# EAGLE schematic boneclamp (EAGLE 6.4)

## Sheet 1 of 7: Beaglebone interface
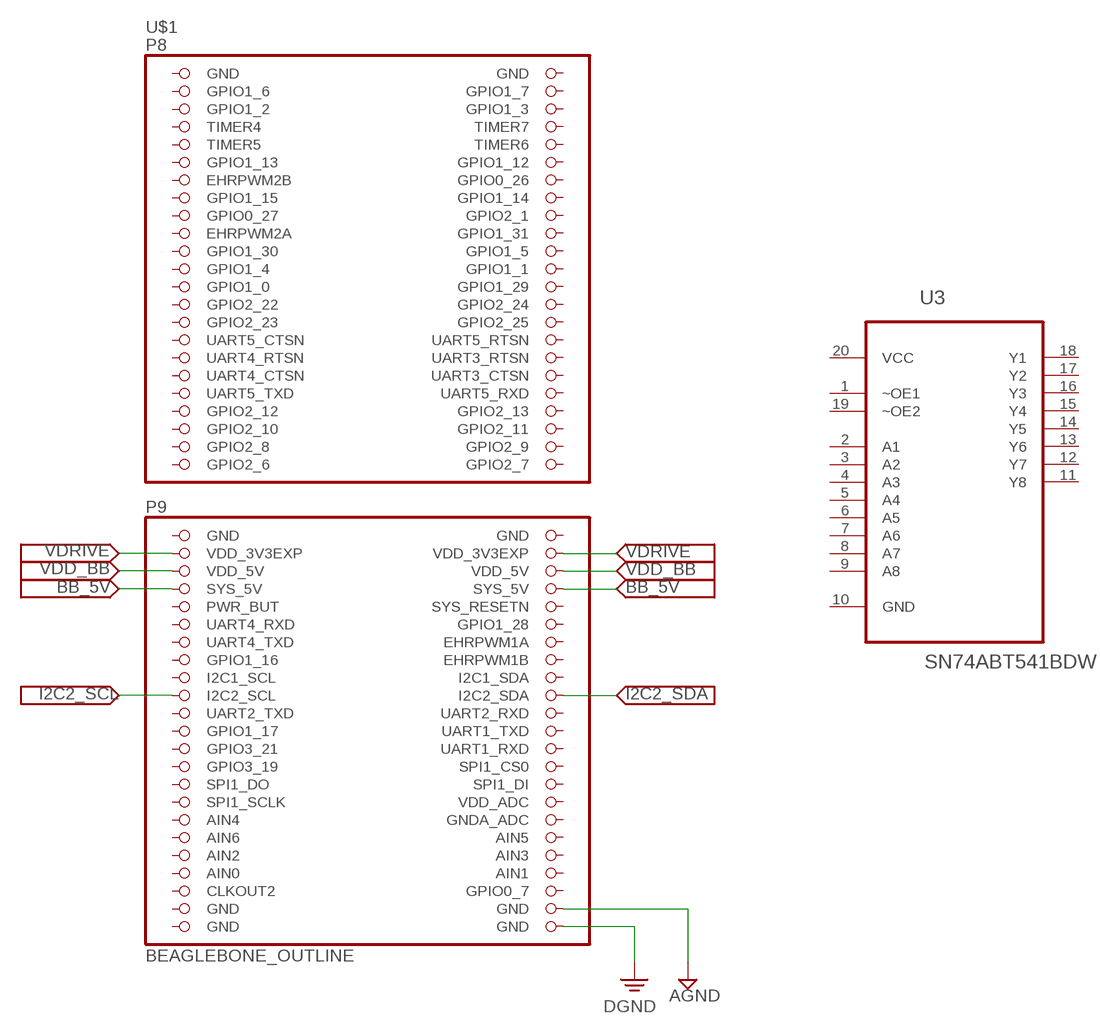
[diagram p0: schematic, sheet 1]

### Parts
U3  SN74ABT541BDW  [SOIC127P1030X265-20N]
U$1  BEAGLEBONE_OUTLINE  [BEAGLEBONE_SHIELD]

### Nets
AGND: U$1.90(GND) ; also sheet 2,4,6,7
BB_5V: U$1.53(SYS_5V) U$1.54(SYS_5V) ; also sheet 6
DGND: U$1.92(GND) ; also sheet 2,5,6
I2C2_SCL: U$1.65(I2C2_SCL) ; also sheet 5
I2C2_SDA: U$1.66(I2C2_SDA) ; also sheet 5
VDD_BB: U$1.51(VDD_5V) U$1.52(VDD_5V) ; also sheet 6
VDRIVE: U$1.49(VDD_3V3EXP) U$1.50(VDD_3V3EXP) ; also sheet 2,5
Unconnected: U3.1(~OE1) U3.2(A1) U3.3(A2) U3.4(A3) U3.5(A4) U3.6(A5) U3.7(A6) U3.8(A7) U3.9(A8) U3.10(GND) U3.11(Y8) U3.12(Y7) U3.13(Y6) U3.14(Y5) U3.15(Y4) U3.16(Y3) U3.17(Y2) U3.18(Y1) U3.19(~OE2) U$1.3(GPIO1_6) U$1.4(GPIO1_7) U$1.5(GPIO1_2) U$1.6(GPIO1_3) U$1.7(TIMER4) U$1.8(TIMER7) U$1.9(TIMER5) U$1.10(TIMER6) U$1.11(GPIO1_13) U$1.12(GPIO1_12) U$1.13(EHRPWM2B) U$1.14(GPIO0_26) U$1.15(GPIO1_15) U$1.16(GPIO1_14) U$1.17(GPIO0_27) U$1.18(GPIO2_1) U$1.19(EHRPWM2A) U$1.20(GPIO1_31) U$1.21(GPIO1_30) U$1.22(GPIO1_5) U$1.23(GPIO1_4) U$1.24(GPIO1_1) U$1.25(GPIO1_0) U$1.26(GPIO1_29) U$1.27(GPIO2_22) U$1.28(GPIO2_24) U$1.29(GPIO2_23) U$1.30(GPIO2_25) U$1.31(UART5_CTSN) U$1.32(UART5_RTSN) U$1.33(UART4_RTSN) U$1.34(UART3_RTSN) U$1.35(UART4_CTSN) U$1.36(UART3_CTSN) U$1.37(UART5_TXD) U$1.38(UART5_RXD) U$1.39(GPIO2_12) U$1.40(GPIO2_13) U$1.41(GPIO2_10) U$1.42(GPIO2_11) U$1.43(GPIO2_8) U$1.44(GPIO2_9) U$1.45(GPIO2_6) U$1.46(GPIO2_7) U$1.55(PWR_BUT) U$1.56(SYS_RESETN) U$1.57(UART4_RXD) U$1.58(GPIO1_28) U$1.59(UART4_TXD) U$1.60(EHRPWM1A) U$1.61(GPIO1_16) U$1.62(EHRPWM1B) U$1.63(I2C1_SCL) U$1.64(I2C1_SDA) U$1.67(UART2_TXD) U$1.68(UART2_RXD) U$1.69(GPIO1_17) U$1.70(UART1_TXD) U$1.71(GPIO3_21) U$1.72(UART1_RXD) U$1.73(GPIO3_19) U$1.74(SPI1_CS0) U$1.75(SPI1_DO) U$1.76(SPI1_DI) U$1.77(SPI1_SCLK) U$1.78(VDD_ADC) U$1.79(AIN4) U$1.80(GNDA_ADC) U$1.81(AIN6) U$1.82(AIN5) U$1.83(AIN2) U$1.84(AIN3) U$1.86(AIN1) U$1.87(CLKOUT2) U$1.88(GPIO0_7)

## Sheet 2 of 7: ADC
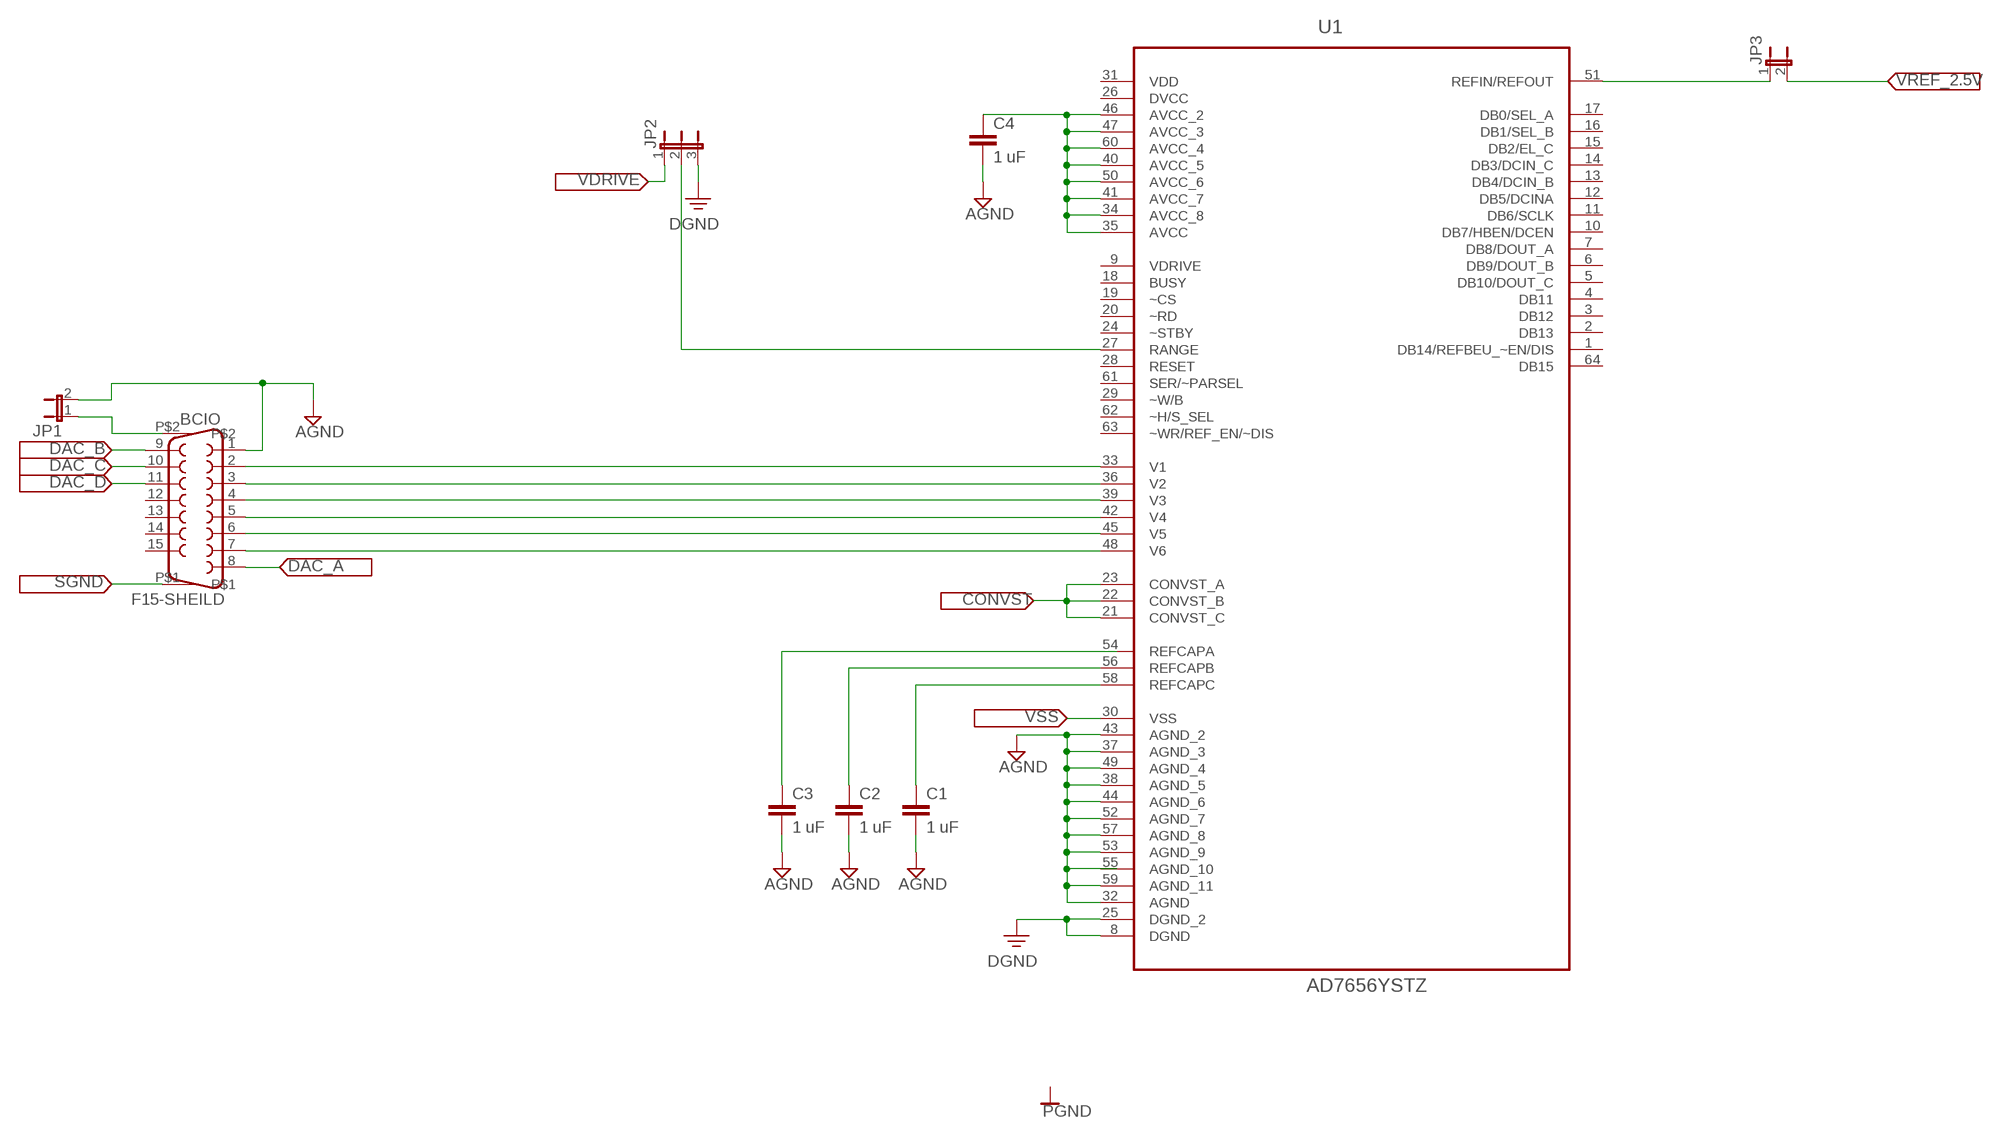
[diagram p1: schematic, sheet 2]

### Parts
BCIO  F15-SHEILD  [HDF15H]
C1  1 uF  C-EUC0402  [C0402]
C2  1 uF  C-EUC0402  [C0402]
C3  1 uF  C-EUC0402  [C0402]
C4  1 uF  C-EUC0402  [C0402]
JP1  JP1E  [JP1]
JP2  JP2E  [JP2]
JP3  JP1E  [JP1]
U1  AD7656YSTZ  [QFP50P1200X1200X160-64N]

### Nets
AGND: BCIO.1 C1.2 C2.2 C3.2 C4.2 JP1.2 U1.32(AGND) U1.37(AGND_3) U1.38(AGND_5) U1.43(AGND_2) U1.44(AGND_6) U1.49(AGND_4) U1.52(AGND_7) U1.53(AGND_9) U1.57(AGND_8) U1.59(AGND_11) ; also sheet 1,4,6,7
CONVST: U1.21(CONVST_C) U1.22(CONVST_B) U1.23(CONVST_A)
DAC_A: BCIO.8 ; also sheet 4
DAC_B: BCIO.9 ; also sheet 4
DAC_C: BCIO.10 ; also sheet 4
DAC_D: BCIO.11 ; also sheet 4
DGND: JP2.3 U1.8(DGND) U1.25(DGND_2) ; also sheet 1,5,6
N$1: BCIO.2 U1.33(V1)
N$2: BCIO.3 U1.36(V2)
N$3: BCIO.4 U1.39(V3)
N$4: BCIO.5 U1.42(V4)
N$5: BCIO.6 U1.45(V5)
N$6: BCIO.7 U1.48(V6)
N$9: C3.1
N$10: C2.1 U1.56(REFCAPB)
N$11: C1.1 U1.58(REFCAPC)
N$12: JP2.2 U1.27(RANGE)
N$13: C4.1 U1.34(AVCC_8) U1.35(AVCC) U1.40(AVCC_5) U1.41(AVCC_7) U1.46(AVCC_2) U1.47(AVCC_3) U1.50(AVCC_6) U1.60(AVCC_4)
N$20: JP3.1 U1.51(REFIN/REFOUT)
SGND: BCIO.P$1 BCIO.P$2 JP1.1
VDRIVE: JP2.1 ; also sheet 1,5
VREF_2.5V: JP3.2 ; also sheet 4,7
VSS: U1.30(VSS) ; also sheet 4
Unconnected: BCIO.12 BCIO.13 BCIO.14 BCIO.15 U1.1(DB14/REFBEU_~EN/DIS) U1.2(DB13) U1.3(DB12) U1.4(DB11) U1.5(DB10/DOUT_C) U1.6(DB9/DOUT_B) U1.7(DB8/DOUT_A) U1.9(VDRIVE) U1.10(DB7/HBEN/DCEN) U1.11(DB6/SCLK) U1.12(DB5/DCINA) U1.13(DB4/DCIN_B) U1.14(DB3/DCIN_C) U1.15(DB2/EL_C) U1.16(DB1/SEL_B) U1.17(DB0/SEL_A) U1.18(BUSY) U1.19(~CS) U1.20(~RD) U1.24(~STBY) U1.28(RESET) U1.29(~W/B) U1.54(REFCAPA) U1.55(AGND_10) U1.61(SER/~PARSEL) U1.62(~H/S_SEL) U1.63(~WR/REF_EN/~DIS) U1.64(DB15)

## Sheet 3 of 7: FILTERS

## Sheet 4 of 7: DAC
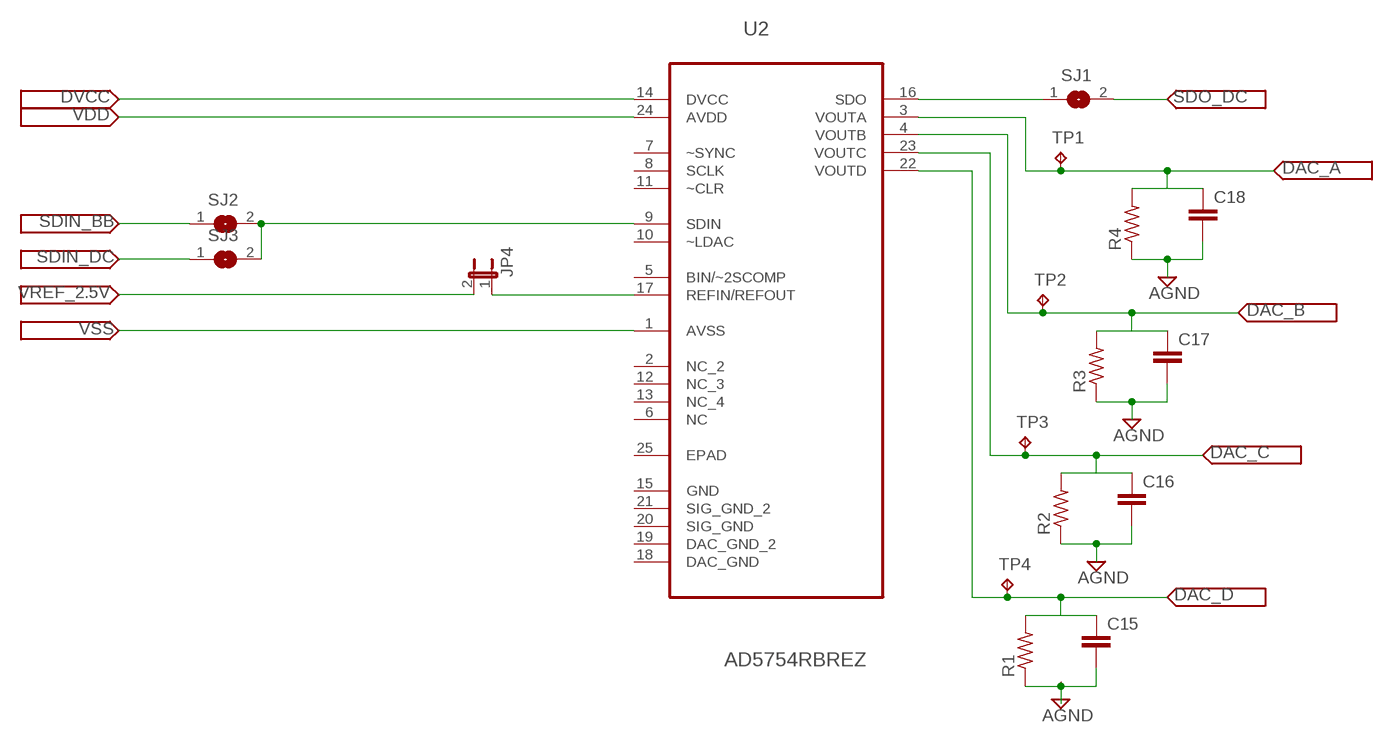
[diagram p2: schematic, sheet 4]

### Parts
C15  C-EUC0603  [C0603]
C16  C-EUC0603  [C0603]
C17  C-EUC0603  [C0603]
C18  C-EUC0603  [C0603]
JP4  JP1E  [JP1]
R1  R-US_R0603  [R0603]
R2  R-US_R0603  [R0603]
R3  R-US_R0603  [R0603]
R4  R-US_R0603  [R0603]
SJ1  SJ  [SJ]
SJ2  SJ  [SJ]
SJ3  SJ  [SJ]
TP1  TPB1,27  [B1,27]
TP2  TPB1,27  [B1,27]
TP3  TPB1,27  [B1,27]
TP4  TPB1,27  [B1,27]
U2  AD5754RBREZ  [SOP65P640X120-25N]

### Nets
AGND: C16.2 C17.2 C18.2 R2.1 R3.1 R4.1 ; also sheet 1,2,6,7
DAC_A: C18.1 R4.2 TP1.TP U2.3(VOUTA) ; also sheet 2
DAC_B: C17.1 R3.2 TP2.TP U2.4(VOUTB) ; also sheet 2
DAC_C: C16.1 R2.2 TP3.TP U2.23(VOUTC) ; also sheet 2
DAC_D: C15.1 R1.2 TP4.TP U2.22(VOUTD) ; also sheet 2
DVCC: U2.14(DVCC) ; also sheet 6
N$7: SJ1.1 U2.16(SDO)
N$8: SJ2.2 SJ3.2 U2.9(SDIN)
N$17: C15.2 R1.1
N$24: JP4.1 U2.17(REFIN/REFOUT)
SDIN_BB: SJ2.1
SDIN_DC: SJ3.1
SDO_DC: SJ1.2
VDD: U2.24(AVDD) ; also sheet 7
VREF_2.5V: JP4.2 ; also sheet 2,7
VSS: U2.1(AVSS) ; also sheet 2
Unconnected: U2.2(NC_2) U2.5(BIN/~2SCOMP) U2.6(NC) U2.7(~SYNC) U2.8(SCLK) U2.10(~LDAC) U2.11(~CLR) U2.12(NC_3) U2.13(NC_4) U2.15(GND) U2.18(DAC_GND) U2.19(DAC_GND_2) U2.20(SIG_GND) U2.21(SIG_GND_2)

## Sheet 5 of 7: BOARD ID
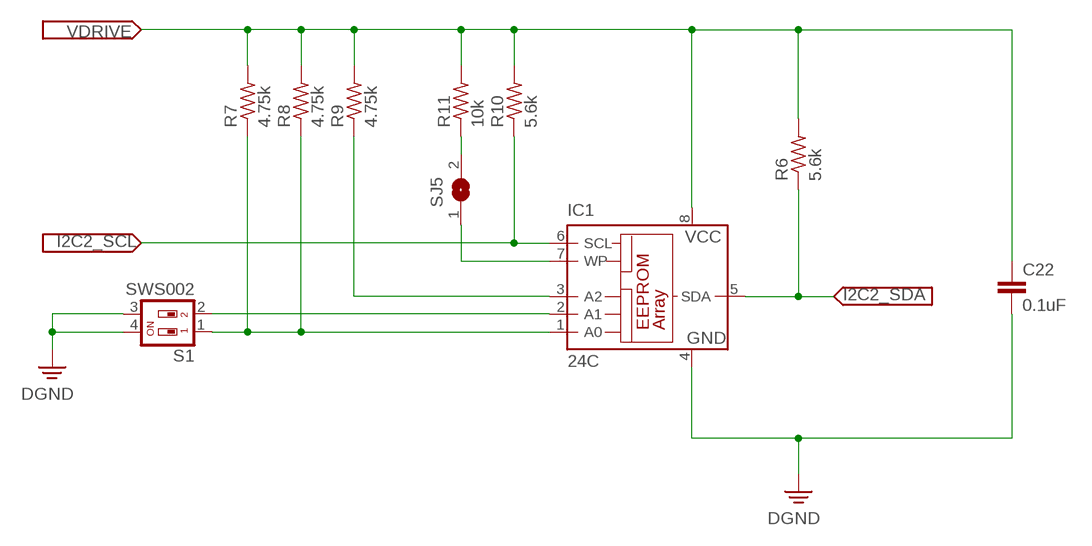
[diagram p3: schematic, sheet 5]

### Parts
C22  0.1uF  C-EUC0603  [C0603]
IC1  24C  [SO-08]
R6  5.6k  R-US_R0603  [R0603]
R7  4.75k  R-US_R0603  [R0603]
R8  4.75k  R-US_R0603  [R0603]
R9  4.75k  R-US_R0603  [R0603]
R10  5.6k  R-US_R0603  [R0603]
R11  10k  R-US_R0603  [R0603]
S1  SWS002  [SMS-002]
SJ5  SJ  [SJ]

### Nets
DGND: C22.2 IC1.4(GND) S1.3 S1.4 ; also sheet 1,2,6
I2C2_SCL: IC1.6(SCL) R10.1 ; also sheet 1
I2C2_SDA: IC1.5(SDA) R6.1 ; also sheet 1
N$14: IC1.1(A0) R7.1 R8.1 S1.1
N$18: IC1.2(A1) S1.2
N$19: IC1.3(A2) R9.1
N$21: IC1.7(WP) SJ5.1
N$22: R11.1 SJ5.2
VDRIVE: C22.1 IC1.8(VCC) R6.2 R7.2 R8.2 R9.2 R10.2 R11.2 ; also sheet 1,2

## Sheet 6 of 7: POWER
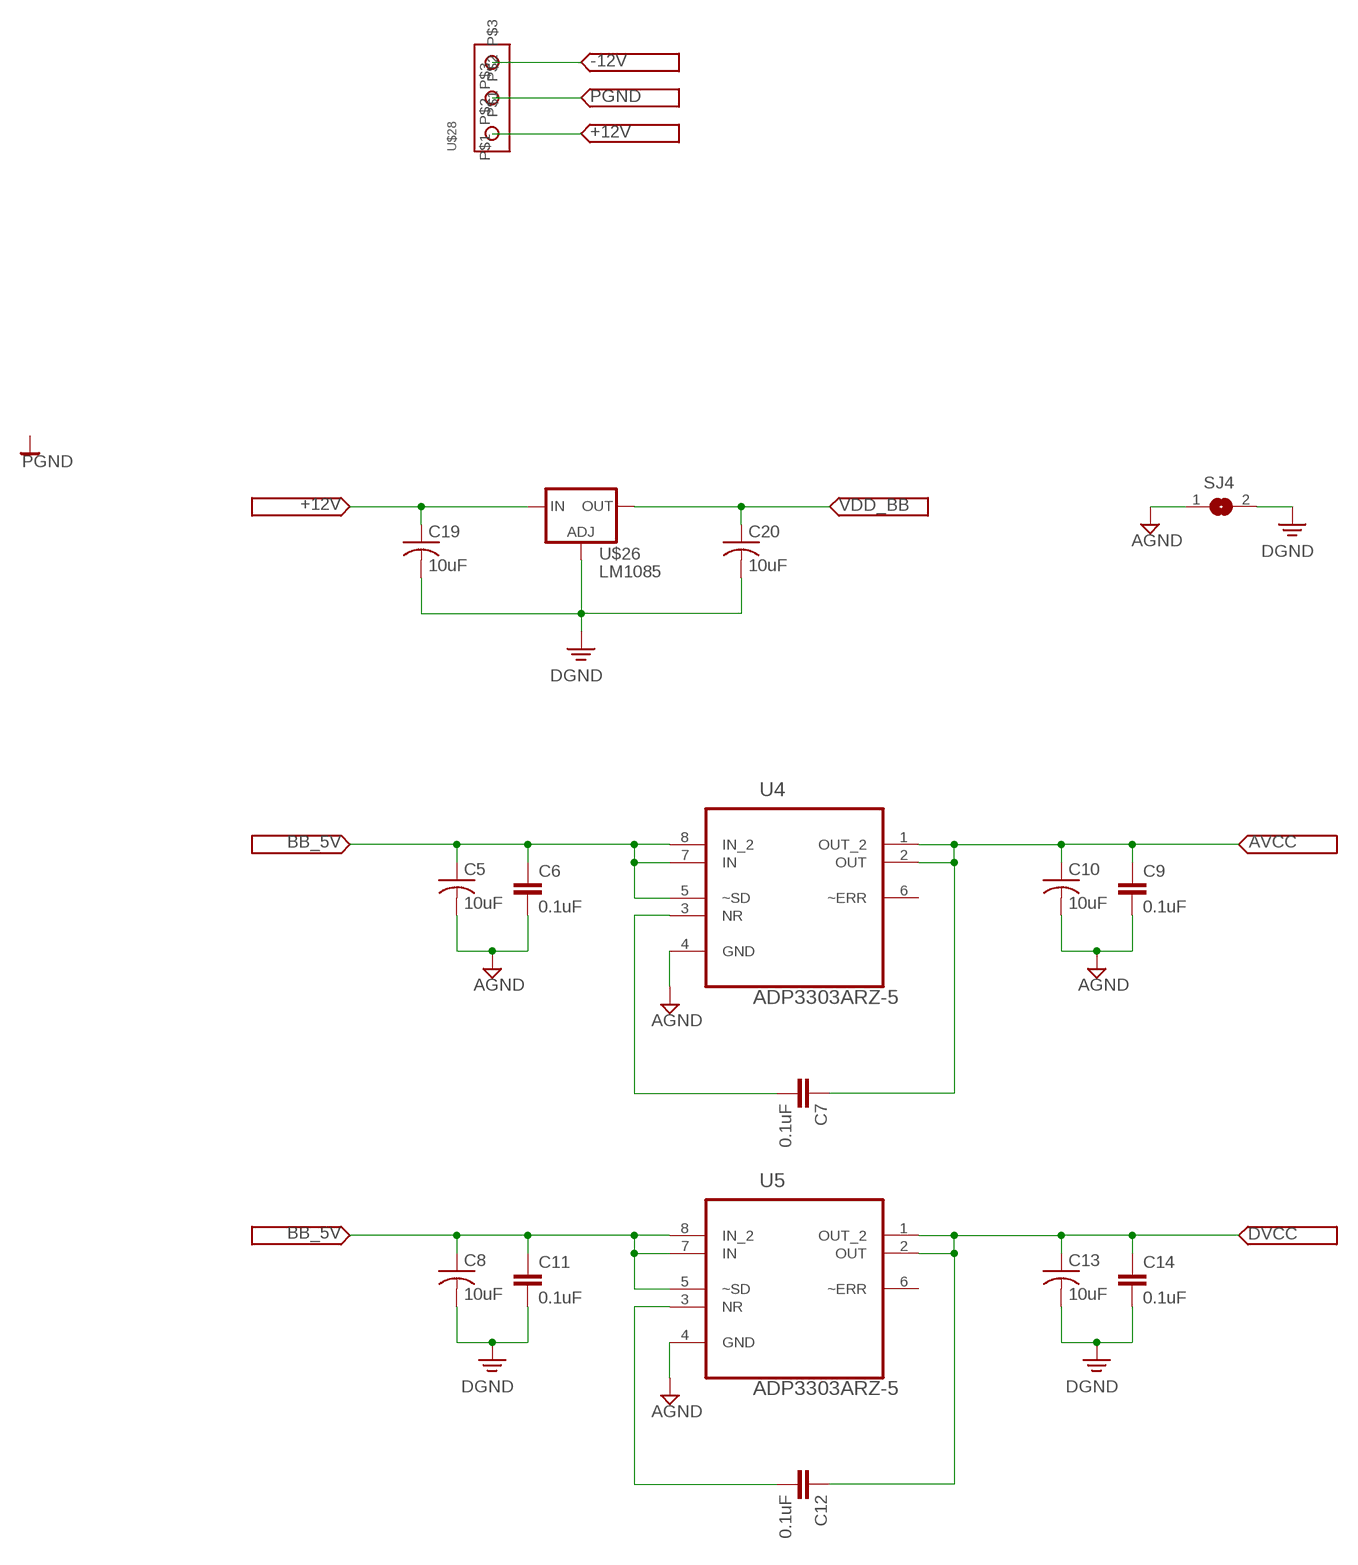
[diagram p4: schematic, sheet 6]

### Parts
C5  10uF  C-USC1206  [C1206]
C6  0.1uF  C-EUC0603  [C0603]
C7  0.1uF  C-EUC0603  [C0603]
C8  10uF  C-USC1206  [C1206]
C9  0.1uF  C-EUC0603  [C0603]
C10  10uF  C-USC1206  [C1206]
C11  0.1uF  C-EUC0603  [C0603]
C12  0.1uF  C-EUC0603  [C0603]
C13  10uF  C-USC1206  [C1206]
C14  0.1uF  C-EUC0603  [C0603]
C19  10uF  C-USC1206  [C1206]
C20  10uF  C-USC1206  [C1206]
SJ4  SJ  [SJ]
U4  ADP3303ARZ-5  [SOIC127P600X175-8N]
U5  ADP3303ARZ-5  [SOIC127P600X175-8N]
U$26  LM1085  [TO263-3]
U$28  SCREW3  [SCREW3]

### Nets
+12V: C19.1 U$26.3(IN)
-12V: U$28.P$3
AGND: C5.2 C6.2 C9.2 C10.2 SJ4.1 U4.4(GND) U5.4(GND) ; also sheet 1,2,4,7
AVCC: C7.1 C9.1 C10.1 U4.1(OUT_2) U4.2(OUT)
BB_5V: C5.1 C6.1 C8.1 C11.1 U4.5(~SD) U4.7(IN) U4.8(IN_2) U5.5(~SD) U5.7(IN) U5.8(IN_2) ; also sheet 1
DGND: C8.2 C11.2 C13.2 C14.2 C19.2 C20.2 SJ4.2 U$26.1(ADJ) ; also sheet 1,2,5
DVCC: C12.1 C13.1 C14.1 U5.1(OUT_2) U5.2(OUT) ; also sheet 4
N$15: C12.2 U5.3(NR)
N$16: C7.2 U4.3(NR)
PGND: U$28.P$2
VDD_BB: C20.1 U$26.2(OUT) U$26.TAB(OUT) ; also sheet 1
Unconnected: U4.6(~ERR) U5.6(~ERR) U$28.P$1

## Sheet 7 of 7: REFERENCES
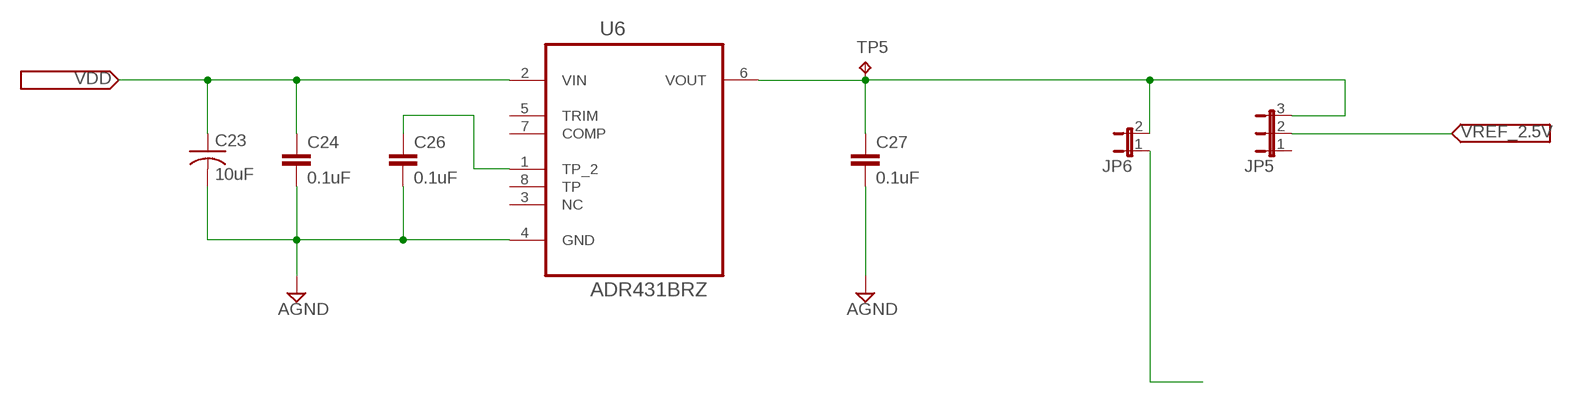
[diagram p5: schematic, sheet 7]

### Parts
C23  10uF  C-USC1206  [C1206]
C24  0.1uF  C-EUC0603  [C0603]
C26  0.1uF  C-EUC0603  [C0603]
C27  0.1uF  C-EUC0603  [C0603]
JP5  JP2E  [JP2]
JP6  JP1E  [JP1]
TP5  TPB1,27  [B1,27]
U6  ADR431BRZ  [SOIC127P600X175-8N]

### Nets
AGND: C23.2 C24.2 C26.2 U6.4(GND) ; also sheet 1,2,4,6
N$23: JP6.1
N$25: C26.1 U6.1(TP_2)
VDD: C23.1 C24.1 U6.2(VIN) ; also sheet 4
VREF_2.5V: JP5.2 ; also sheet 2,4
VREF_OUT: C27.1 JP5.3 JP6.2 TP5.TP U6.6(VOUT)
Unconnected: C27.2 JP5.1 U6.3(NC) U6.5(TRIM) U6.7(COMP) U6.8(TP)

## Power pins joined to a net without a drawn wire
AIN0: U$1.85(AIN0)
DVCC: U1.26(DVCC)
EPAD: U2.25(EPAD)
GND: U$1.1(GND) U$1.2(GND) U$1.47(GND) U$1.48(GND) U$1.89(GND) U$1.91(GND)
VCC: U3.20(VCC)
VDD: U1.31(VDD)

## Library data of the parts
BCIO = adafruit:F15-SHEILD
C1-C4 C6 C7 C9 C11 C12 C14-C18 C22 C24 C26 C27 = rcl:C-EU: CAPACITOR, European symbol
C5 C8 C10 C13 C19 C20 C23 = rcl:C-US: CAPACITOR, American symbol
IC1 = on-semiconductor-01:24C*: Serial EEPROM 1 K/2 K/4 K
JP1 JP3 JP4 JP6 = jumper:JP1E: JUMPER
JP2 JP5 = jumper:JP2E: JUMPER
R1-R4 R6-R11 = rcl:R-US_: RESISTOR, American symbol
S1 = smd-special:SWS002: SMD Dip Switch 2 pol.
SJ1-SJ5 = jumper:SJ: SMD solder JUMPER
TP1-TP5 = testpad:TP: Test pad
U1 = analog-devices-01:AD7656YSTZ: ADC; MPN: AD7656YSTZ; OC_FARNELL: 1274233; OC_NEWARK: 19M0880; PACKAGE: LQFP-64; SUPPLIER: ANALOG DEVICES
U2 = analog-devices-01:AD5754RBREZ: DAC; MPN: AD5754RBREZ; OC_FARNELL: 1786050; OC_NEWARK: 51P3755; PACKAGE: TSSOP-24; SUPPLIER: Analog Devices
U3 = ti-extended:SN74ABT541BDW: OCTAL BUFFERS/DRIVERS; MPN: SN74ABT541BDW; OC_FARNELL: 9590170; OC_NEWARK: 85F222; PACKAGE: SOIC-20; SUPPLIER: Texas Instruments
U4 U5 = analog-devices-01:ADP3303ARZ-5: High Accuracy anyCAP? 200 mA Low Dropout Linear Regulator; MPN: ADP3303ARZ-5; OC_FARNELL: 1319307; OC_NEWARK: 19M8716; PACKAGE: SOIC-8; SUPPLIER: ANALOG DEVICES
U6 = analog-devices-01:ADR431BRZ: Ultralow Noise XFET Voltage References with Current Sink and Source Capability; MPN: ADR431BRZ; OC_FARNELL: 1498664; OC_NEWARK: 12M8194; PACKAGE: SOIC-8; SUPPLIER: Analog Devices
U$1 = adafruit:BEAGLEBONE_OUTLINE: Should match A3 pinout - but not completely tested
U$26 = boneclamp:LM1085
U$28 = boneclamp:SCREW3